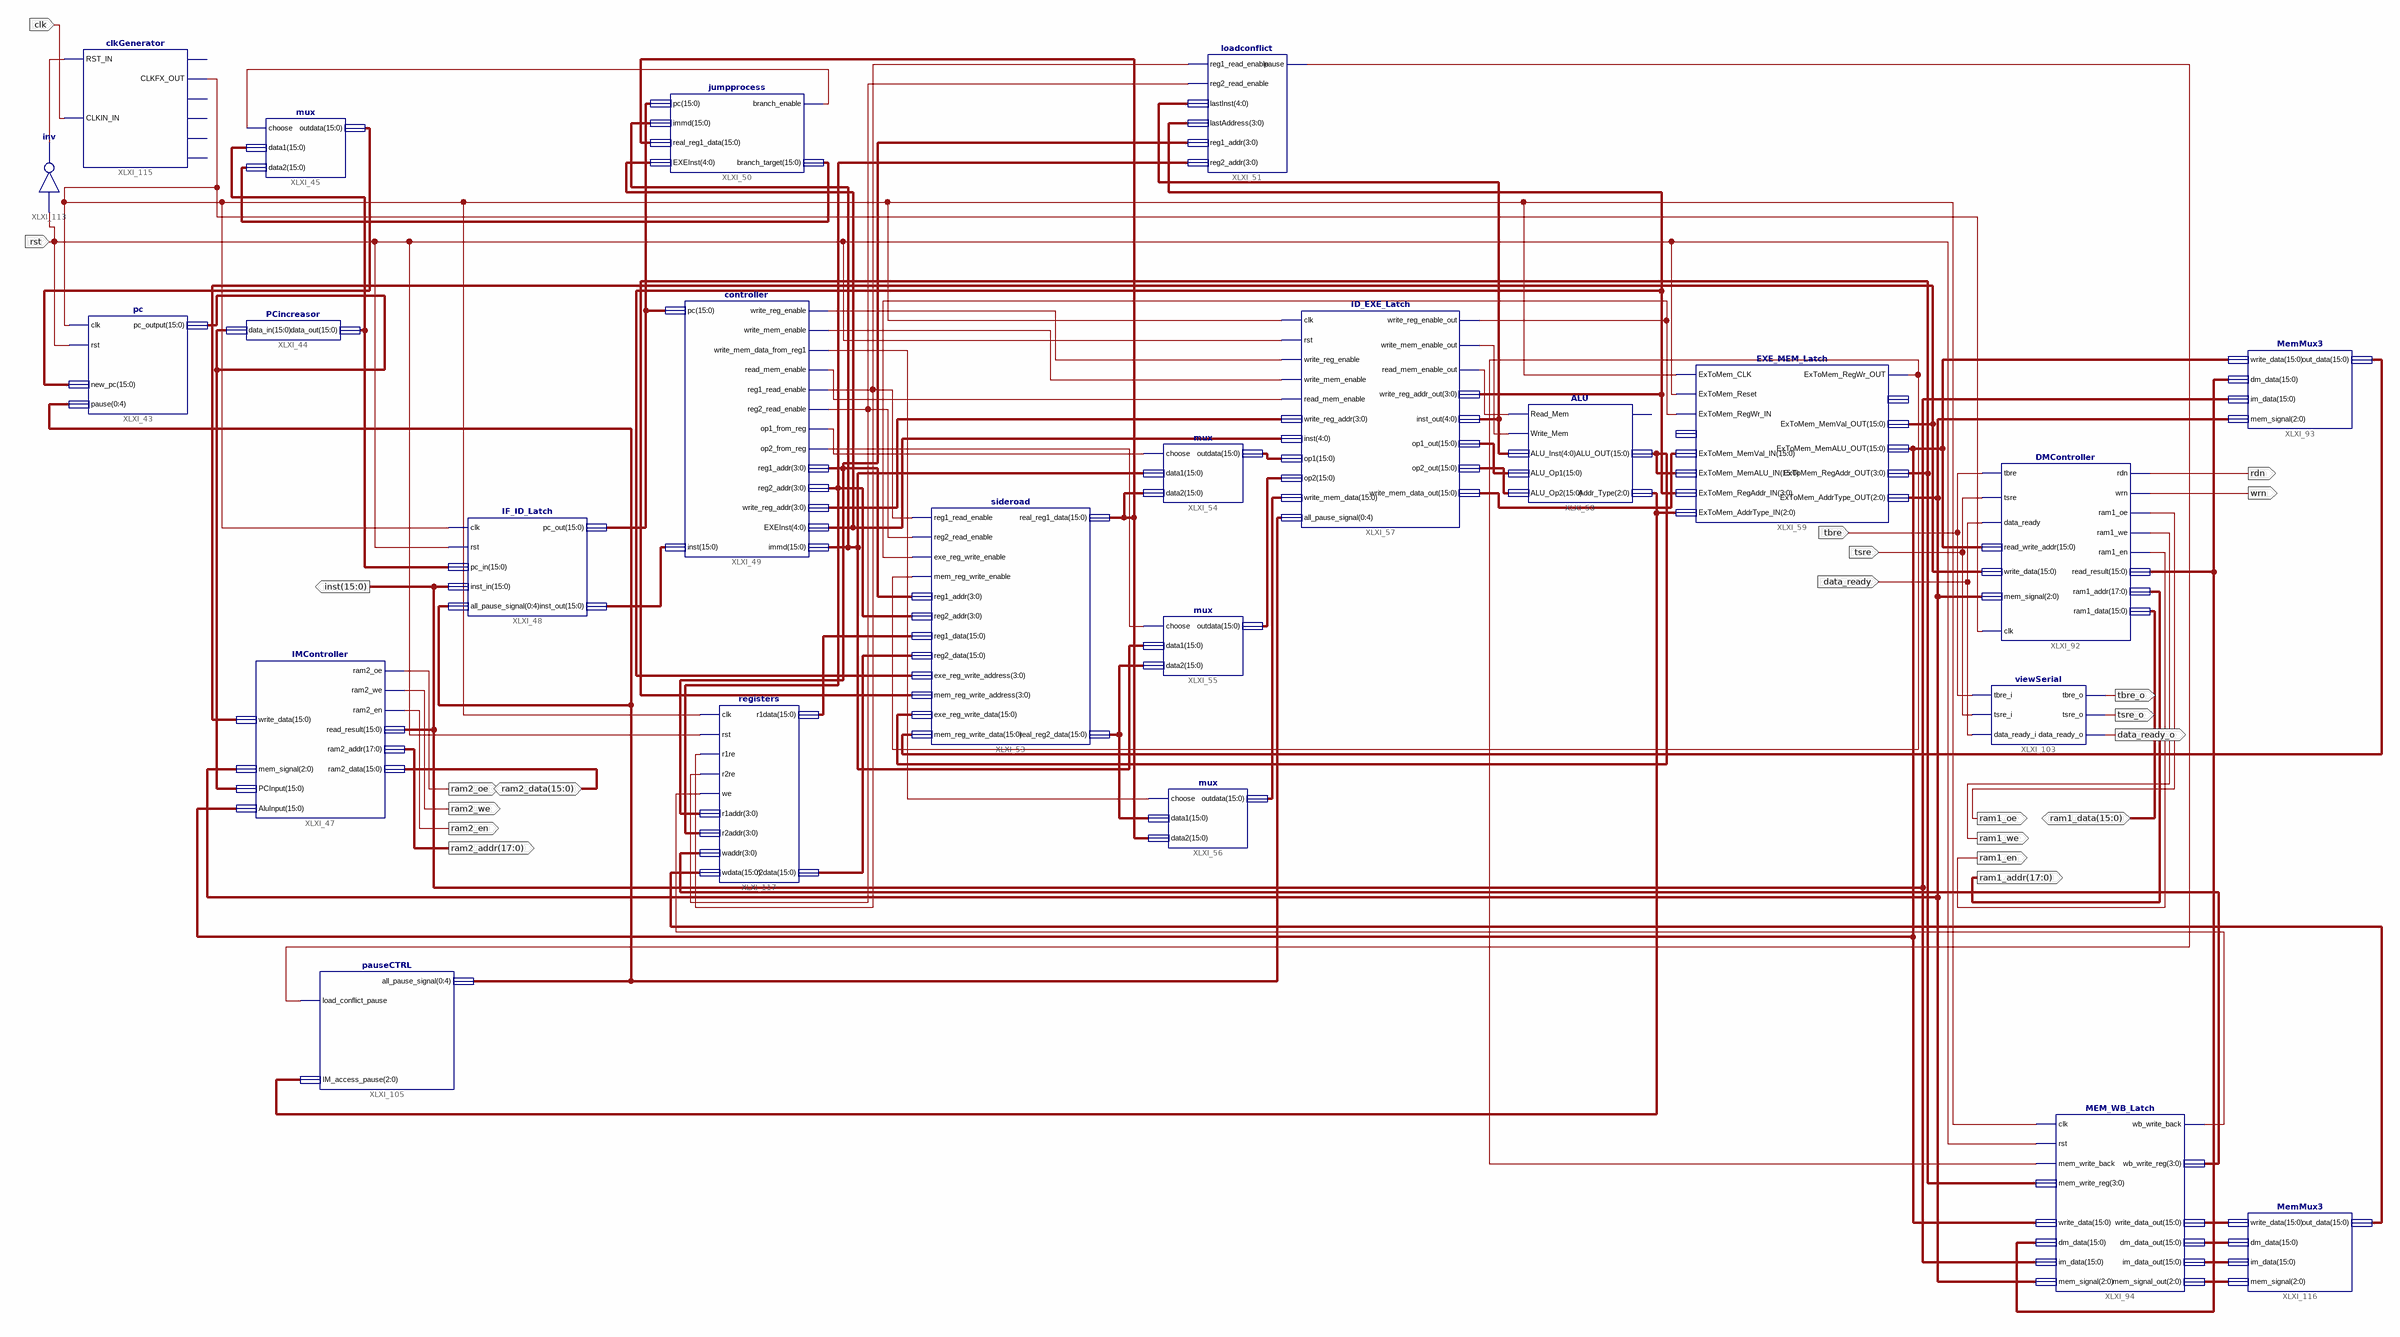
[diagram p0: schematic sheet 1]
// Xilinx ISE schematic TopEntity.sch (spartan3e) as structural Verilog: 24 symbols, 21 ports
module TopEntity (
  input  rst,
  input  tbre,
  input  tsre,
  input  data_ready,
  input  clk,
  inout  [15:0] ram2_data,
  inout  [15:0] ram1_data,
  output ram2_oe,
  output ram2_we,
  output ram2_en,
  output [17:0] ram2_addr,
  output ram1_oe,
  output ram1_we,
  output ram1_en,
  output [15:0] inst,
  output [17:0] ram1_addr,
  output rdn,
  output wrn,
  output tbre_o,
  output tsre_o,
  output data_ready_o
);

  wire clk_out, reg1_read_enable, XLXN_228, XLXN_240, XLXN_241, XLXN_249, XLXN_268, XLXN_276, XLXN_277,
       XLXN_293, XLXN_308, XLXN_338, XLXN_449, XLXN_462, XLXN_483, XLXN_485, XLXN_533;
  wire [2:0] XLXN_519, XLXN_541, XLXN_545;
  wire [3:0] waddr, XLXN_229, XLXN_230, XLXN_278, XLXN_307, XLXN_334;
  wire [4:0] XLXN_224, XLXN_294, XLXN_480;
  wire [15:0] XLXN_210, XLXN_216, XLXN_222, XLXN_223, XLXN_226, XLXN_227, XLXN_233, XLXN_234, XLXN_251,
       XLXN_252, XLXN_260, XLXN_261, XLXN_264, XLXN_295, XLXN_296, XLXN_316, XLXN_451, XLXN_467, XLXN_515,
       XLXN_534, XLXN_537, XLXN_540, XLXN_542, XLXN_543, XLXN_544, XLXN_547;

  EXE_MEM_Latch XLXI_59 (
    .ExToMem_CLK(clk_out), .ExToMem_Reset(rst), .ExToMem_RegWr_IN(XLXN_449), .ExToMem_MemVal_IN(XLXN_515),
    .ExToMem_MemALU_IN(XLXN_451), .ExToMem_RegAddr_IN(XLXN_307), .ExToMem_AddrType_IN(XLXN_519),
    .ExToMem_RegWr_OUT(XLXN_462), .ExToMem_MemVal_OUT(XLXN_316), .ExToMem_MemALU_OUT(XLXN_540),
    .ExToMem_RegAddr_OUT(XLXN_334), .ExToMem_AddrType_OUT(XLXN_541));  // open: ExToMem_PC_IN, ExToMem_PC_OUT
  pc XLXI_43 (
    .clk(clk_out), .rst(rst), .pause({XLXN_480[0], XLXN_480[1], XLXN_480[2], XLXN_480[3], XLXN_480[4]}),
    .new_pc(XLXN_216), .pc_output(XLXN_210));
  PCincreasor XLXI_44 (.data_in(XLXN_210), .data_out(XLXN_467));
  mux XLXI_45 (.choose(XLXN_228), .data1(XLXN_467), .data2(XLXN_227), .outdata(XLXN_216));
  IMController XLXI_47 (
    .write_data(XLXN_316), .mem_signal(XLXN_541), .ram2_data(ram2_data), .ram2_oe(ram2_oe),
    .ram2_we(ram2_we), .ram2_en(ram2_en), .read_result(inst), .ram2_addr(ram2_addr), .PCInput(XLXN_210),
    .AluInput(XLXN_540));
  IF_ID_Latch XLXI_48 (
    .clk(clk_out), .rst(rst), .pc_in(XLXN_467), .inst_in(inst),
    .all_pause_signal({XLXN_480[0], XLXN_480[1], XLXN_480[2], XLXN_480[3], XLXN_480[4]}), .pc_out(XLXN_222),
    .inst_out(XLXN_223));
  controller XLXI_49 (
    .pc(XLXN_222), .inst(XLXN_223), .write_reg_enable(XLXN_276), .write_mem_enable(XLXN_268),
    .write_mem_data_from_reg1(XLXN_249), .read_mem_enable(XLXN_277), .reg1_read_enable(reg1_read_enable),
    .reg2_read_enable(XLXN_485), .op1_from_reg(XLXN_240), .op2_from_reg(XLXN_241), .reg1_addr(XLXN_229),
    .reg2_addr(XLXN_230), .write_reg_addr(XLXN_278), .EXEInst(XLXN_224), .immd(XLXN_226));
  sideroad XLXI_53 (
    .reg1_read_enable(reg1_read_enable), .reg2_read_enable(XLXN_485), .exe_reg_write_enable(XLXN_449),
    .mem_reg_write_enable(XLXN_462), .reg1_addr(XLXN_229), .reg2_addr(XLXN_230), .reg1_data(XLXN_233),
    .reg2_data(XLXN_234), .exe_reg_write_address(XLXN_307), .mem_reg_write_address(XLXN_334),
    .exe_reg_write_data(XLXN_451), .mem_reg_write_data(XLXN_534), .real_reg1_data(XLXN_251),
    .real_reg2_data(XLXN_252));
  jumpprocess XLXI_50 (
    .pc(XLXN_222), .immd(XLXN_226), .real_reg1_data(XLXN_251), .EXEInst(XLXN_224), .branch_enable(XLXN_228),
    .branch_target(XLXN_227));
  mux XLXI_54 (.choose(XLXN_240), .data1(XLXN_226), .data2(XLXN_251), .outdata(XLXN_260));
  mux XLXI_55 (.choose(XLXN_241), .data1(XLXN_226), .data2(XLXN_252), .outdata(XLXN_261));
  mux XLXI_56 (.choose(XLXN_249), .data1(XLXN_252), .data2(XLXN_251), .outdata(XLXN_264));
  ID_EXE_Latch XLXI_57 (
    .clk(clk_out), .rst(rst), .write_reg_enable(XLXN_276), .write_mem_enable(XLXN_268),
    .read_mem_enable(XLXN_277), .write_reg_addr(XLXN_278), .inst(XLXN_224), .op1(XLXN_260), .op2(XLXN_261),
    .write_mem_data(XLXN_264),
    .all_pause_signal({XLXN_480[0], XLXN_480[1], XLXN_480[2], XLXN_480[3], XLXN_480[4]}),
    .write_reg_enable_out(XLXN_449), .write_mem_enable_out(XLXN_293), .read_mem_enable_out(XLXN_308),
    .write_reg_addr_out(XLXN_307), .inst_out(XLXN_294), .op1_out(XLXN_295), .op2_out(XLXN_296),
    .write_mem_data_out(XLXN_515));
  ALU XLXI_58 (
    .Read_Mem(XLXN_308), .Write_Mem(XLXN_293), .ALU_Inst(XLXN_294), .ALU_Op1(XLXN_295), .ALU_Op2(XLXN_296),
    .ALU_OUT(XLXN_451), .Addr_Type(XLXN_519));  // open: ALU_Pause
  DMController XLXI_92 (
    .clk(clk_out), .tbre(tbre), .tsre(tsre), .data_ready(data_ready), .read_write_addr(XLXN_540),
    .write_data(XLXN_316), .mem_signal(XLXN_541), .ram1_data(ram1_data), .rdn(rdn), .wrn(wrn),
    .ram1_oe(ram1_oe), .ram1_we(ram1_we), .ram1_en(ram1_en), .read_result(XLXN_537), .ram1_addr(ram1_addr));
  MemMux3 XLXI_93 (
    .write_data(XLXN_540), .dm_data(XLXN_537), .im_data(inst), .mem_signal(XLXN_541), .out_data(XLXN_534));
  MEM_WB_Latch XLXI_94 (
    .clk(clk_out), .rst(rst), .mem_write_back(XLXN_462), .mem_write_reg(XLXN_334), .write_data(XLXN_540),
    .dm_data(XLXN_537), .im_data(inst), .mem_signal(XLXN_541), .wb_write_back(XLXN_338),
    .wb_write_reg(waddr), .write_data_out(XLXN_542), .dm_data_out(XLXN_543), .im_data_out(XLXN_544),
    .mem_signal_out(XLXN_545));
  loadconflict XLXI_51 (
    .reg1_read_enable(reg1_read_enable), .reg2_read_enable(XLXN_485), .lastInst(XLXN_294),
    .lastAddress(XLXN_307), .reg1_addr(XLXN_229), .reg2_addr(XLXN_230), .pause(XLXN_483));
  viewSerial XLXI_103 (
    .tbre_i(tbre), .tsre_i(tsre), .data_ready_i(data_ready), .tbre_o(tbre_o), .tsre_o(tsre_o),
    .data_ready_o(data_ready_o));
  pauseCTRL XLXI_105 (
    .load_conflict_pause(XLXN_483),
    .all_pause_signal({XLXN_480[0], XLXN_480[1], XLXN_480[2], XLXN_480[3], XLXN_480[4]}),
    .IM_access_pause(XLXN_519));
  not XLXI_113 (XLXN_533, rst);
  clkGenerator XLXI_115 (
    .RST_IN(XLXN_533), .CLKIN_IN(clk), .CLKFX_OUT(clk_out));  // open: LOCKED_OUT, CLKDV_OUT, CLK2X_OUT, CLKIN_IBUFG_OUT, CLK0_OUT
  MemMux3 XLXI_116 (
    .write_data(XLXN_542), .dm_data(XLXN_543), .im_data(XLXN_544), .mem_signal(XLXN_545), .out_data(XLXN_547));
  registers XLXI_117 (
    .clk(clk_out), .rst(rst), .r1re(reg1_read_enable), .r2re(XLXN_485), .we(XLXN_338), .r1addr(XLXN_229),
    .r2addr(XLXN_230), .waddr(waddr), .wdata(XLXN_547), .r1data(XLXN_233), .r2data(XLXN_234));
endmodule
